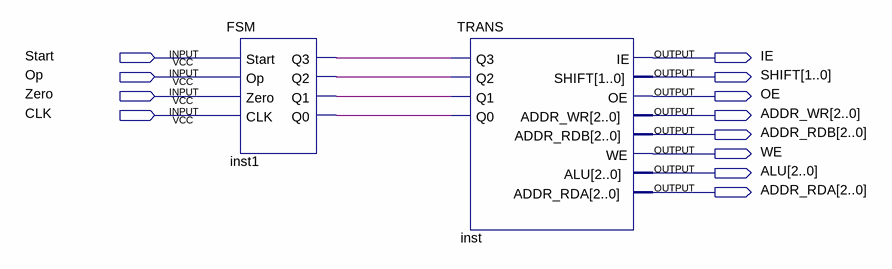
[diagram p0: schematic sheet]
// Quartus schematic CONTROLLER.bdf as structural Verilog: 2 symbols, 12 pins
module CONTROLLER (
  input  Start,
  input  Op,
  input  Zero,
  input  CLK,
  output IE,
  output [1:0] SHIFT,
  output OE,
  output [2:0] ADDR_WR,
  output [2:0] ADDR_RDB,
  output WE,
  output [2:0] ALU,
  output [2:0] ADDR_RDA
);

  wire inst1_q0, inst1_q1, inst1_q2, inst1_q3;

  FSM inst1 (
    .Start(Start), .Op(Op), .Zero(Zero), .CLK(CLK), .Q3(inst1_q3), .Q2(inst1_q2), .Q1(inst1_q1), .Q0(inst1_q0));
  TRANS inst (
    .Q3(inst1_q3), .Q2(inst1_q2), .Q1(inst1_q1), .Q0(inst1_q0), .IE(IE), .SHIFT(SHIFT), .OE(OE),
    .ADDR_WR(ADDR_WR), .ADDR_RDB(ADDR_RDB), .WE(WE), .ALU(ALU), .ADDR_RDA(ADDR_RDA));
endmodule
